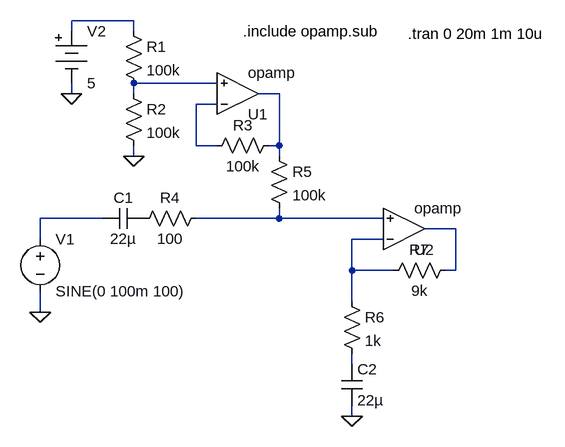
[diagram p0: schematic Draft_levantamiento_amplificacion.asc]
Draft_levantamiento_amplificacion.asc, the LTspice schematic file:
Version 4
SHEET 1 880 680
WIRE 208 -48 112 -48
WIRE 112 -32 112 -48
WIRE 208 -32 208 -48
WIRE 336 48 208 48
WIRE 112 64 112 48
WIRE 208 64 208 48
WIRE 432 64 400 64
WIRE 336 80 304 80
WIRE 304 144 304 80
WIRE 336 144 304 144
WIRE 432 144 432 64
WIRE 432 144 416 144
WIRE 208 160 208 144
WIRE 432 160 432 144
WIRE 160 256 64 256
WIRE 432 256 432 240
WIRE 432 256 304 256
WIRE 592 256 432 256
WIRE 704 272 656 272
WIRE 64 288 64 256
WIRE 592 288 544 288
WIRE 544 336 544 288
WIRE 608 336 544 336
WIRE 704 336 704 272
WIRE 704 336 688 336
WIRE 544 384 544 336
WIRE 64 400 64 368
WIRE 544 480 544 464
WIRE 544 560 544 544
FLAG 112 64 0
FLAG 208 160 0
FLAG 64 400 0
FLAG 544 560 0
SYMBOL Misc\\battery 112 -48 R0
WINDOW 123 0 0 Left 2
WINDOW 39 0 0 Left 2
SYMATTR InstName V2
SYMATTR Value 5
SYMBOL Opamps\\opamp 368 128 M180
SYMATTR InstName U1
SYMBOL res 192 -48 R0
SYMATTR InstName R1
SYMATTR Value 100k
SYMBOL res 192 48 R0
SYMATTR InstName R2
SYMATTR Value 100k
SYMBOL res 432 128 R90
WINDOW 0 0 56 VBottom 2
WINDOW 3 32 56 VTop 2
SYMATTR InstName R3
SYMATTR Value 100k
SYMBOL cap 224 240 R90
WINDOW 0 0 32 VBottom 2
WINDOW 3 32 32 VTop 2
SYMATTR InstName C1
SYMATTR Value 22µ
SYMBOL voltage 64 272 R0
WINDOW 123 0 0 Left 2
WINDOW 39 0 0 Left 2
SYMATTR InstName V1
SYMATTR Value SINE(0 100m 100)
SYMBOL res 320 240 R90
WINDOW 0 0 56 VBottom 2
WINDOW 3 32 56 VTop 2
SYMATTR InstName R4
SYMATTR Value 100
SYMBOL Opamps\\opamp 624 336 M180
SYMATTR InstName U2
SYMBOL res 528 368 R0
SYMATTR InstName R6
SYMATTR Value 1k
SYMBOL res 704 320 R90
WINDOW 0 0 56 VBottom 2
WINDOW 3 32 56 VTop 2
SYMATTR InstName R7
SYMATTR Value 9k
SYMBOL cap 528 480 R0
SYMATTR InstName C2
SYMATTR Value 22µ
SYMBOL res 416 144 R0
SYMATTR InstName R5
SYMATTR Value 100k
TEXT 376 -32 Left 2 !.include opamp.sub
TEXT 630 -28 Left 2 !.tran 0 20m 1m 10u

The netlist it stands for:
* Draft_levantamiento_amplificacion.asc
V2 N001 0 5
XU1 N004 N002 N003 opamp Aol=100K GBW=10Meg  ; pins invin noninvin out
R1 N001 N002 100k
R2 N002 0 100k
R3 N003 N004 100k
C1 P001 N005 22µ
V1 N005 0 SINE(0 100m 100)
R4 N006 P001 100
XU2 N008 N006 N007 opamp Aol=100K GBW=10Meg  ; pins invin noninvin out
R6 N008 N009 1k
R7 N007 N008 9k
C2 N009 0 22µ
R5 N003 N006 100k
.include opamp.sub
.tran 0 20m 1m 10u
.backanno
.end